# EAGLE design sonopi-dac (EAGLE 9.5.2)
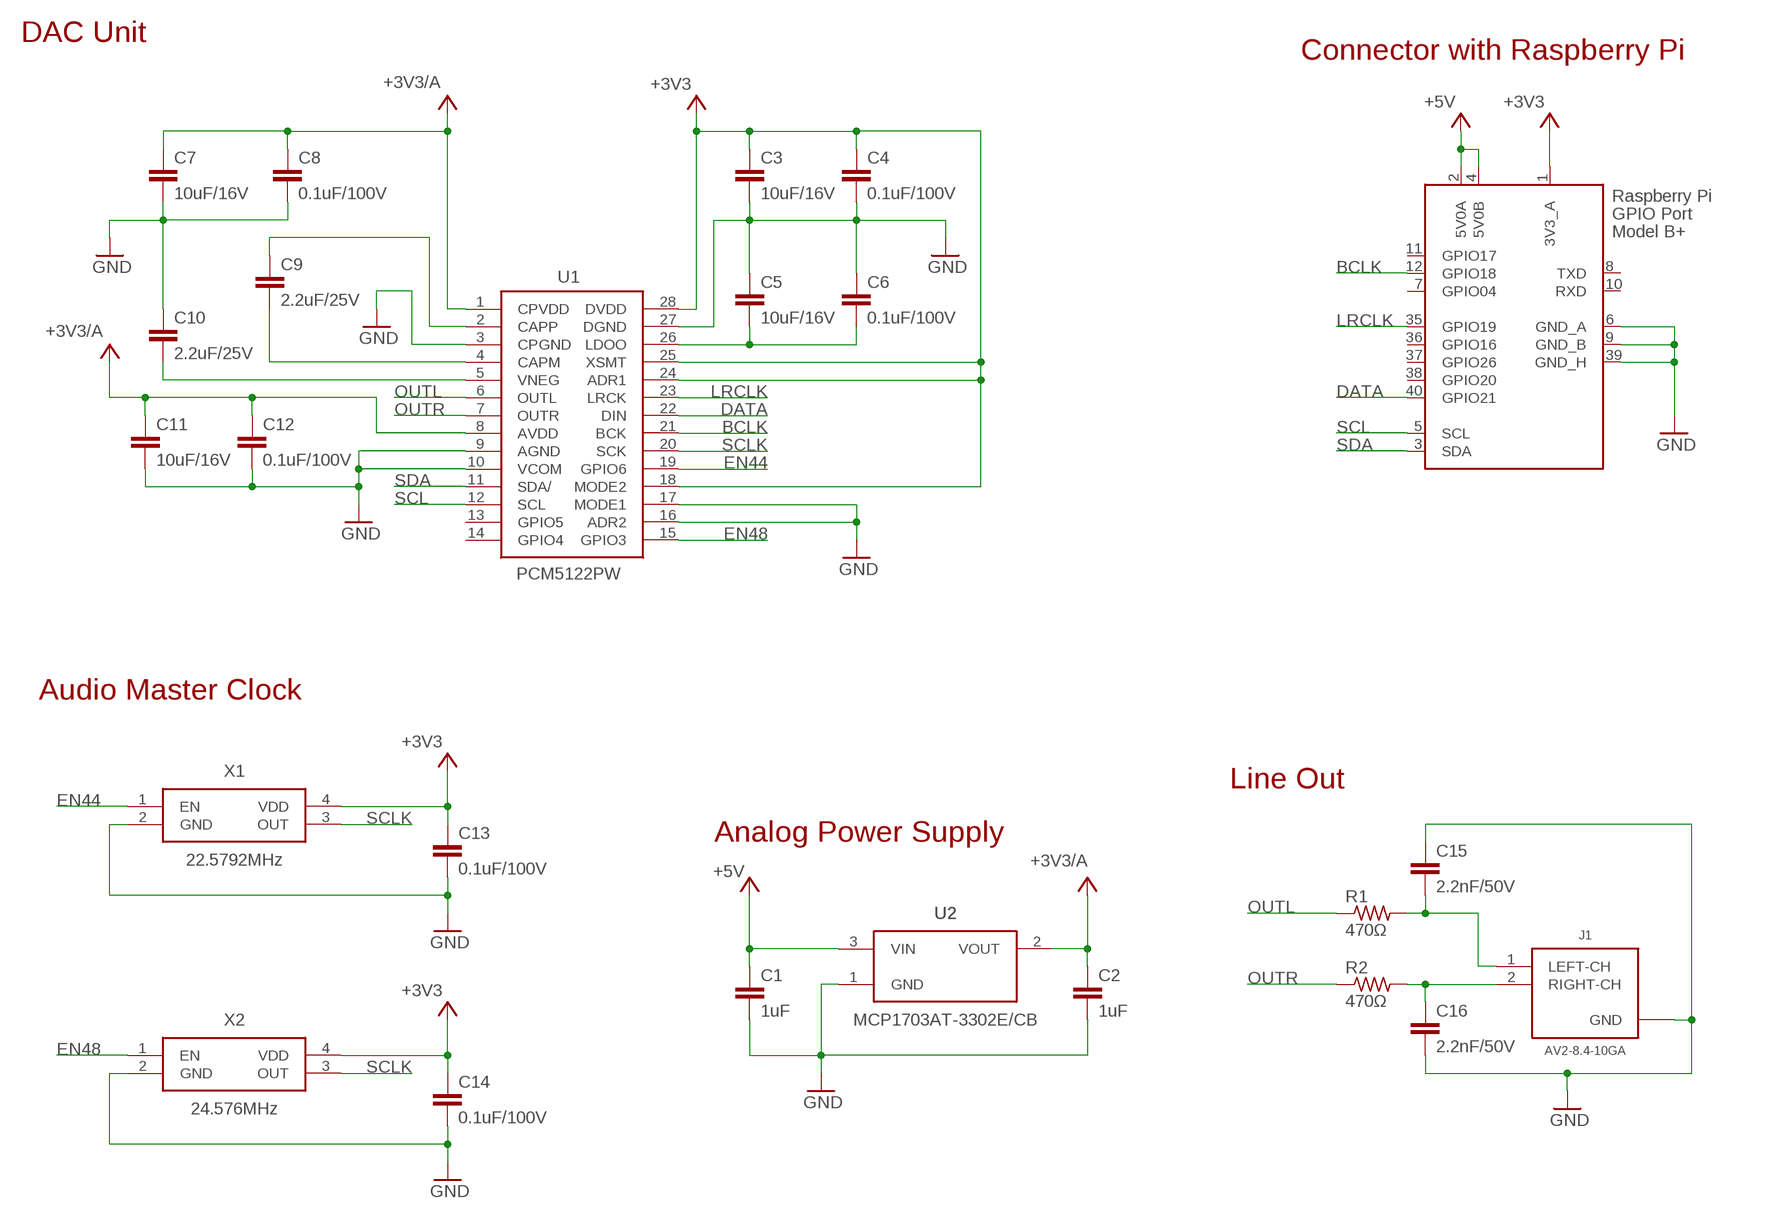
[diagram p0: schematic, sheet 1]

## Parts
C1  1uF  C-EUC0603  [C0603]
C2  1uF  C-EUC0603  [C0603]
C3  10uF/16V  C-EUC3216  [C3216]
C4  0.1uF/100V  C-EUC0603  [C0603]
C5  10uF/16V  C-EUC3216  [C3216]
C6  0.1uF/100V  C-EUC0603  [C0603]
C7  10uF/16V  C-EUC3216  [C3216]
C8  0.1uF/100V  C-EUC0603  [C0603]
C9  2.2uF/25V  C-EUC0805  [C0805]
C10  2.2uF/25V  C-EUC0805  [C0805]
C11  10uF/16V  C-EUC3216  [C3216]
C12  0.1uF/100V  C-EUC0603  [C0603]
C13  0.1uF/100V  C-EUC0603  [C0603]
C14  0.1uF/100V  C-EUC0603  [C0603]
C15  2.2nF/50V  C-EUC0603  [C0603]
C16  2.2nF/50V  C-EUC0603  [C0603]
J1  AV2-8.4-10GA  2CH-RCAAITENDO  [AV2-8.4-10GA]
J2  RASPI_BOARD_B+#_ZERO  [RASPI_BOARD_B+HAT_ZERO]
R1  470Ω  R-US_R0603  [R0603]
R2  470Ω  R-US_R0603  [R0603]
U1  PCM5122PW  [SOP65P640X120-28N]
U2  MCP1703AT-3302E/CB  LDO-REGULATOR  [SOT23]
X1  22.5792MHz  OSC-3225  [3225-SMD]
X2  24.576MHz  OSC-3225  [3225-SMD]

## Nets
+3V3: C3.1 C4.1 C13.1 C14.1 J2.1(3V3_A) U1.18(MODE2) U1.24(ADR1) U1.25(XSMT) U1.28(DVDD) X1.4(VDD) X2.4(VDD)
+3V3/A: C2.1 C7.1 C8.1 C11.1 C12.1 U1.1(CPVDD) U1.8(AVDD) U2.2(VOUT)
+5V [pwr]: C1.1 J2.2(5V0A) J2.4(5V0B) U2.3(VIN)
BCLK: J2.12(GPIO18) U1.21(BCK)
CAPM: C9.2 U1.4(CAPM)
CAPP: C9.1 U1.2(CAPP)
DATA: J2.40(GPIO21) U1.22(DIN)
EN44: U1.19(GPIO6) X1.1(EN)
EN48: U1.15(GPIO3) X2.1(EN)
GND [gnd]: C1.2 C2.2 C3.2 C4.2 C5.1 C6.1 C7.2 C8.2 C10.1 C11.2 C12.2 C13.2 C14.2 C15.1 C16.2 J1.G1(GND) J1.G2(GND) J1.G3(GND) J1.G4(GND) J2.6(GND_A) J2.9(GND_B) J2.39(GND_H) U1.3(CPGND) U1.9(AGND) U1.10(VCOM) U1.16(ADR2) U1.17(MODE1) U1.27(DGND) U2.1(GND) X1.2(GND) X2.2(GND)
LCH: C15.2 J1.1(LEFT-CH) R1.2
LDOO: C5.2 C6.2 U1.26(LDOO)
LRCLK: J2.35(GPIO19) U1.23(LRCK)
OUTL: R1.1 U1.6(OUTL)
OUTR: R2.1 U1.7(OUTR)
RCH: C16.1 J1.2(RIGHT-CH) R2.2
SCL: J2.5(SCL) U1.12(SCL)
SCLK: U1.20(SCK) X1.3(OUT) X2.3(OUT)
SDA: J2.3(SDA) U1.11(SDA/)
VNEG: C10.2 U1.5(VNEG)
Unconnected: J2.7(GPIO04) J2.8(TXD) J2.10(RXD) J2.11(GPIO17) J2.36(GPIO16) J2.37(GPIO26) J2.38(GPIO20) U1.13(GPIO5) U1.14(GPIO4)

## Notes on the sheet
- DAC Unit
- Connector with Raspberry Pi
- Audio Master Clock
- Line Out
- Analog Power Supply

## Library data of the parts
C1-C16 = rcl:C-EU: CAPACITOR, European symbol; SPICEPREFIX: C
J1 = RCA-jack:2CH-RCA
J2 = raspi-zero-i2s:RASPI_BOARD_B+#: Raspberry Pi GPIO connector with markings for the outer dimensions of the Raspberry Pi board model B+ with different sets of drill holes or mounting pads All pins connected
R1 R2 = rcl:R-US_: RESISTOR, American symbol; SPICEPREFIX: R
U1 = PCM5122:PCM5122PW: 2V RMS DIRECTPATH 112dB Audio Stereo DAC with PCM Interface and Fixed Audio Processing Source: Datasheet <http://www.ti.com/general/docs/lit/getliterature.tsp?genericPartNumber=PCM5122&&fileType=pdf>; DESCRIPTION: 2V RMS DIRECTPATH 112dB Audio Stereo DAC with PCM Interface and Fixed Audio Processing; HEIGHT: 1.2mm; MANUFACTURER_NAME: Texas Instruments; MANUFACTURER_PART_NUMBER: PCM5122PW; MOUSER_PART_NUMBER: 595-PCM5122PW; MOUSER_PRICE-STOCK: https://www.mouser.com/Search/Refine.aspx?Keyword=595-PCM5122PW; RS_PART_NUMBER: 8143732P; RS_PRICE-STOCK: http://uk.rs-online.com/web/p/products/8143732P
U2 = SOT23_Module:LDO-REGULATOR
X1 X2 = oscillator:OSC

## Net classes
1 gnd: width 0.2 mm, clearance 0.1 mm
2 pwr: width 0.2 mm, clearance 0.1 mm

## Board
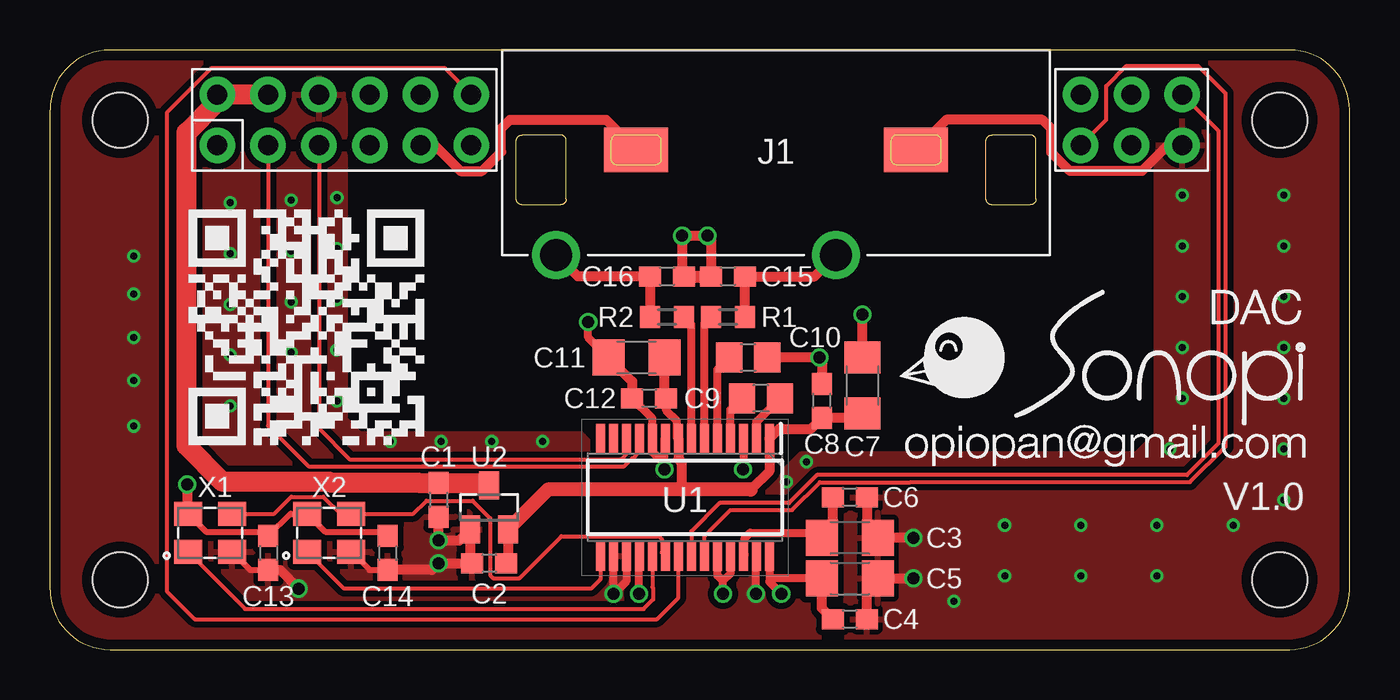
[diagram p1: board, top side]
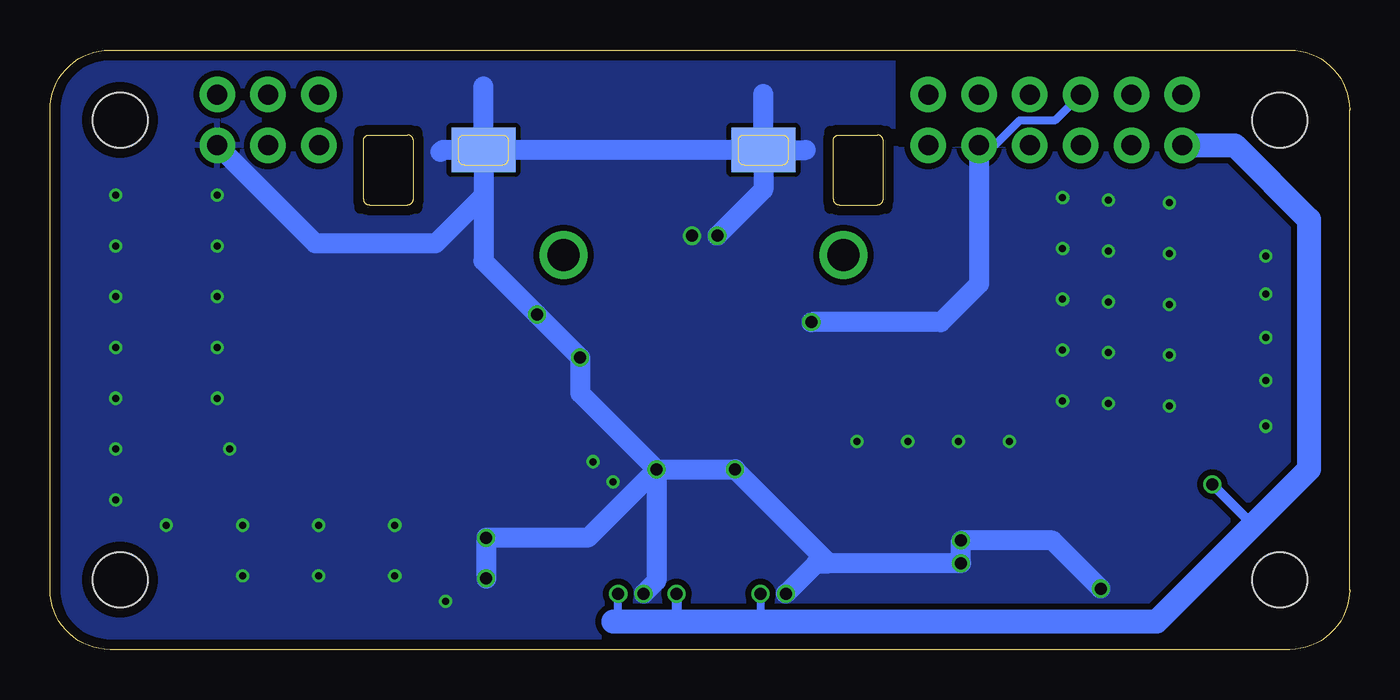
[diagram p2: board, bottom side, seen from below]

Size 65 x 30 mm. Coordinates in mm from the lower left corner, seen from the top.
Copper layers (1*16): Top 0.035mm / dielectric 1.6mm / Bottom 0.035mm
Design rules "Elecrow_2-layer_PCB_eagle_rule": minimum track width 6mil, minimum drill 12mil, track to track 6mil, track to pad 6mil, pad to pad 6mil, via to via 8mil, smd to smd 0mil, copper to edge 20mil, drill to drill 10mil, minimum pad ring 6mil, minimum via ring 6mil, stop-mask expansion 0mil, vias tented up to drill 100mil, thermal gap 10mil

### Footprints (pad centres in the part's own frame; a part is rotated, then mirrored left to right if it is on the bottom)
C0603 = smd 1.1 x 1: 1 -0.85,0; 2 0.85,0
C3216 = smd 1.6 x 1.8: 1 -1.4,0; 2 1.4,0
C0805 = smd 1.3 x 1.5: 1 -0.95,0; 2 0.95,0
AV2-8.4-10GA = drill 1.6: 1 -3,10.25; 2 11,10.25 | smd 3.2 x 2.2: G1 7,5; G3 -7,5 | smd 3.2 x 2.2 bottom: G2 7,5; G4 -7,5
RASPI_BOARD_B+HAT_ZERO = drill 1 pad 1.778: 1 8.37,25.23; 2 8.37,27.77; 3 10.91,25.23; 4 10.91,27.77; 5 13.45,25.23; 6 13.45,27.77; 7 15.99,25.23; 8 15.99,27.77; 9 18.53,25.23; 10 18.53,27.77; 11 21.07,25.23; 12 21.07,27.77; 35 51.55,25.23; 36 51.55,27.77; 37 54.09,25.23; 38 54.09,27.77; 39 56.63,25.23; 40 56.63,27.77 | hole 2.75: 3.5,26.5; 61.5,26.5; 3.5,3.5; 61.5,3.5
R0603 = smd 1 x 1.1: 1 -0.85,0; 2 0.85,0
SOP65P640X120-28N = smd 1.475 x 0.45: 1 -2.938,4.225; 2 -2.938,3.575; 3 -2.938,2.925; 4 -2.938,2.275; 5 -2.938,1.625; 6 -2.938,0.975; 7 -2.938,0.325; 8 -2.938,-0.325; 9 -2.938,-0.975; 10 -2.938,-1.625; 11 -2.938,-2.275; 12 -2.938,-2.925; 13 -2.938,-3.575; 14 -2.938,-4.225; 15 2.938,-4.225; 16 2.938,-3.575; 17 2.938,-2.925; 18 2.938,-2.275; 19 2.938,-1.625; 20 2.938,-0.975; 21 2.938,-0.325; 22 2.938,0.325; 23 2.938,0.975; 24 2.938,1.625; 25 2.938,2.275; 26 2.938,2.925; 27 2.938,3.575; 28 2.938,4.225
SOT23 = smd 1 x 1.4: 1 -0.95,-1.1; 2 0.95,-1.1; 3 0,1.1
3225-SMD = smd 1.4 x 1.2: 1 -1.1,-0.95; 2 1.1,-0.95; 3 1.1,0.95; 4 -1.1,0.95

### Placement (x,y rotation side)
C1  19.43,7.49 270 top
C2  21.97,4.32 180 top
C3  40.01,3.56 0 top
C4  40.01,1.52 0 top
C5  40.01,5.59 180 top
C6  40.01,7.62 180 top
C7  40.64,13.21 90 top
C8  38.61,12.45 90 top
C9  35.56,12.57 180 top
C10  34.92,14.61 180 top
C11  29.34,14.61 180 top
C12  29.97,12.57 180 top
C13  10.92,4.83 270 top
C14  16.89,4.83 270 top
C15  33.91,18.67 0 top
C16  30.86,18.67 0 top
J1  36.32,30 180 top
J2  0,0 0 top
R1  33.91,16.64 0 top
R2  30.86,16.64 180 top
U1  31.75,7.62 270 top
U2  21.97,7.11 0 top
U$1  [SONOPI-DAC-LOGO]  41.78,7.87 0 top
U$2  [SONOPI-DAC-QRCODE]  5.33,8.64 0 top
X1  8,5.84 0 top
X2  13.97,5.84 0 top

### Tracks (layer width: path | path; a pad name or v marks a point on that pad's centre or on a via)
+3V3  (via drill 0.6)
  Top 0.3: C14.1 16.68,5.89 13.77,5.89 X2.4 12.04,6.79 C13.1 10.71,5.89 7.8,5.89 X1.4
  Top 0.4: U1.28 35.98,3.4 | 35.98,3.4 v36.58,2.79 | C3.1 36.14,3.56 35.98,3.4 | v29.46,2.79 29.46,4.67 U1.18 | v33.66,2.79 33.66,3.43 | U1.24 33.38,3.71 33.66,3.43 | U1.25 34.02,3.8 33.66,3.43
  Top 0.5: C4.1 38.6,2.07 C3.1 | v6.86,8.26 6.86,6.83 X1.4
  Bottom 0.4: 36.83,1.4 36.58,1.65 v36.58,2.79 | v29.46,2.79 29.46,1.65 29.21,1.4
  Bottom 0.5: v6.86,8.26 4.89,6.29 4.89,6.16 | v33.66,2.79 33.66,1.4
  Bottom 1.2: 36.83,1.4 33.66,1.4 29.21,1.4 9.65,1.4 4.89,6.16 2.03,9.02 2.03,21.52 5.74,25.23 J2.1
+3V3/A
  Top 0.4: U1.8 31.35,10.63 31.35,11.44 30.82,11.97 C12.1
  Top 0.5: C12.1 30.74,12.66 C11.1 | C7.1 40.43,11.6 C8.1 38.06,11.05 36.47,11.05 U1.1 35.98,8.92 35.05,8 | U2.2 22.92,4.42 C2.1 | U1.8 31.43,9.54 31.59,9.37 31.59,8.04 31.62,8
  Top 0.7: U2.2 24.91,8 31.62,8 35.05,8
+5V
  Top 1: J2.4 J2.2 8.37,27.41 6.83,25.87 6.83,10.19 8.62,8.4 13.99,8.4 14.04,8.34 18.42,8.34 19.05,8.34 C1.1 21.84,8.34 U2.3
BCLK
  Top 0.2: J2.12 19.76,29.08 8.07,29.08 5.84,26.86 5.84,2.92 7.24,1.52 30.35,1.52 31.43,2.6 U1.21
CAPM
  Top 0.4: U1.4 34.02,11.99 C9.2
CAPP
  Top 0.4: U1.2 35.33,11.39 C9.1
DATA
  Top 0.2: J2.40 58.45,25.95 58.45,10.32 56.87,8.73 38.36,8.73 36.97,7.34 33.5,7.34 32.08,5.91 U1.22
EN44
  Top 0.2: U1.19 30.12,3.13 30.17,3.09 30.17,2.5 29.7,2.03 9.76,2.03 X1.1
EN48
  Top 0.2: U1.15 27.52,3.52 27.05,3.05 14.71,3.05 X2.1
GND  (via drill 0.35, 0.6)
  Top 0.3: X1.2 10.02,3.98 C13.2 | X2.2 15.99,3.98 C14.2
  Top 0.4: U1.3 v34.67,9.02 | v30.73,9.02 30.73,9.27 | 30.73,9.27 30.73,10.52 U1.9 | 30.73,9.27 30.12,9.88 U1.10 30.12,11.57 C12.2 | C11.2 26.92,15.62 v26.92,16.38 | 40.85,3.01 C3.2 | v35.31,2.79 35.31,4.66 U1.27 | U1.16 28.19,4.66 v28.19,2.79 28.82,3.42 U1.17
  Top 0.5: C10.1 v38.48,14.61 38.61,14.48 C8.2 | C7.2 v40.64,16.76 | C11.2 29.12,13.42 C12.2 | C4.2 40.85,3.01 | C3.2 v43.18,3.56 | v43.18,5.59 C5.1 40.85,6.14 C6.1 | C1.2 v19.43,5.46 20.47,5.46 U2.1 21.02,4.42 C2.2 v19.43,4.32 19.09,3.98 C14.2 | C16.2 31.62,18.76 v31.62,20.7 v32.89,20.7 33.06,20.54 C15.1 | C13.2 11.52,3.98 v12.45,3.05 | J2.39 55.92,25.23 54.62,23.94 51.02,23.94 50.08,24.87 50.08,26.06 49.64,26.51 44.83,26.51 J1.G4 | J2.9 19.24,25.23 20.54,23.94 21.61,23.94 22.56,24.9 22.56,26.06 23.01,26.51 27.81,26.51 J1.G2
  Top 0.6: C16.2 C15.1
  Bottom 0.4: J2.6 14.75,26.47 16.5,26.47 17.75,25.23 J2.9
  Bottom 1: J1.G2 J1.G4 | J1.G4 43.32,22.72 45.72,20.32 51.72,20.32 J2.39 | J1.G4 43.32,19.45 v40.64,16.76 v38.48,14.61 38.48,12.83 v34.67,9.02 | J1.G2 29.32,23 v31.62,20.7 | J2.9 18.53,18.3 20.45,16.38 v26.92,16.38 | v34.67,9.02 v30.73,9.02 26.04,4.32 | v34.67,9.02 34.67,3.43 v35.31,2.79 | v34.67,9.02 38.1,5.59 v43.18,5.59 v43.18,3.56 | 26.04,4.32 v19.43,4.32 v19.43,5.46 14.86,5.46 v12.45,3.05 | v28.19,2.79 26.67,4.32 26.04,4.32 | J1.G2 29.21,25.11 | J1.G2 27.2,25 | J1.G4 43.32,28.18 | J1.G4 43.34,25.02 | J1.G2 29.32,27.8 | J1.G4 45.36,25 45.47,24.89
  other vias: 4.19,19.68 4.19,17.78 4.19,15.62 4.19,13.46 4.19,11.18 9.02,22.35 9.02,19.81 9.02,17.27 9.02,14.73 9.02,12.19 12.06,22.48 12.06,19.94 12.06,17.4 12.06,14.86 12.06,12.32 14.35,22.61 14.35,20.07 14.35,17.53 14.35,14.99 14.35,12.45 17.02,10.41 19.56,10.41 22.1,10.41 24.64,10.41 56.64,22.73 36.83,8.38 37.85,9.4 56.64,20.19 56.64,17.65 56.64,15.11 56.64,12.57 56.01,10.03 61.72,22.73 61.72,20.19 61.72,17.65 61.72,15.11 61.72,12.57 61.72,10.03 61.72,7.49 59.18,6.22 55.37,6.22 51.56,6.22 47.75,6.22 47.75,3.68 45.21,2.41 51.56,3.68 55.37,3.68
  pour Bottom (isolate 0.3): 22.86,30.48 22.86,25.27 22.61,25.02 3.81,25.02 2.41,23.62 2.41,0 2.29,-0.13 64.77,-0.13 64.77,30.23 64.64,30.35 24,30.35 23.88,30.48
  pour Top (isolate 0.3): 14.73,30.23 14.73,11.56 15.49,10.79 26.54,10.79 26.67,10.67 28.83,8.51 28.83,8 35.81,8 36.07,8.26 37.59,9.78 44.07,9.78 54.36,9.78 55.37,10.79 55.37,29.97 64.64,29.97 64.9,29.72 64.9,-0.13 0.13,-0.13 0,0 0,29.72 0.25,29.97 11.18,29.97 11.3,30.1 11.43,30.23
LCH
  Top 0.5: J1.1 38.24,18.67 C15.2 R1.2
LDOO
  Top 0.4: U1.26 34.75,4.75 34.75,5.57 35.02,5.84 38.35,5.84 C5.2
  Top 0.5: C5.2 39.16,6.14 C6.2
LRCLK
  Top 0.2: J2.35 52.83,26.51 52.83,28.19 53.85,29.21 57.4,29.21 58.8,27.81 58.8,10.16 57.02,8.38 43.05,8.38 43.04,8.37 38.5,8.37 37.11,6.99 34.04,6.99 33.34,6.29 33.21,6.16 32.73,5.67 U1.23
OUTL
  Top 0.4: U1.6 32.73,16.3 R1.1
OUTR
  Top 0.4: U1.7 32.08,16.27 R2.1
RCH
  Top 0.5: J1.2 26.4,18.67 C16.1 R2.2
SCL
  Top 0.2: J2.5 13.45,11.06 14.99,9.53 28.57,9.53 28.83,9.78 U1.12
SCLK
  Top 0.2: X1.3 11.21,6.79 12.06,7.64 13.68,7.64 14.53,6.79 X2.3 18.17,6.79 18.83,7.45 21.14,7.45 22.02,6.57 22.02,3.71 22.17,3.57 23.48,3.57 25.58,5.67 30.45,5.67 30.6,5.52 30.6,4.86 U1.20
SDA
  Top 0.2: U1.11 29.48,9.92 29.3,9.74 29.3,9.72 29.16,9.57 29.12,9.57 28.72,9.17 18.67,9.17 18.65,9.17 12.93,9.17 10.91,11.19 J2.3
VNEG
  Top 0.4: U1.5 33.38,14.01 C10.2

### Text on the board
tPlace: V1.0